# EAGLE schematic rStep_v1 (EAGLE 5.08)

## Sheet 1 of 2
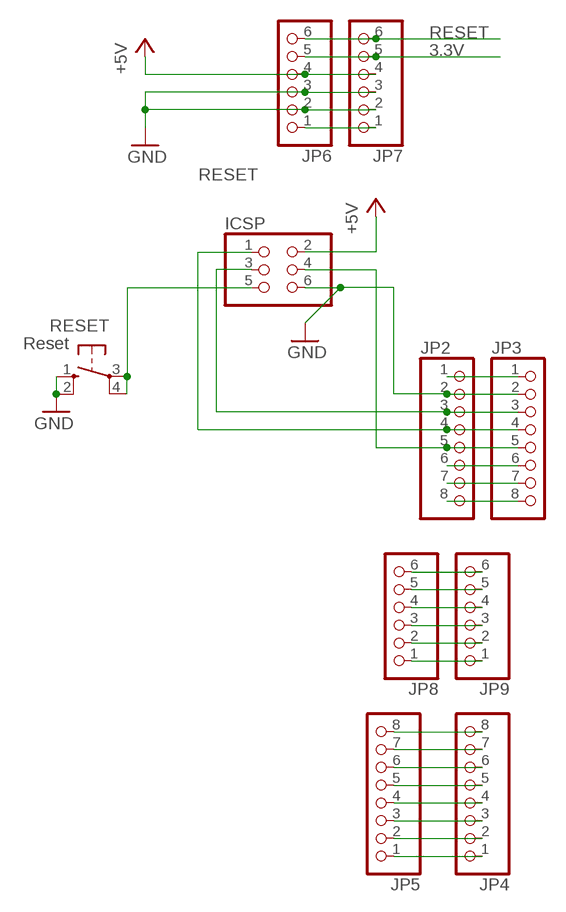
[diagram p0: schematic, sheet 1]

### Parts
ICSP  PINHD-2X3  [2X03]
JP2  PINHD-1X8B  [1X08-BIG]
JP3  PINHD-1X8CLEANBIG  [1X08-CLEANBIG]
JP4  PINHD-1X8B  [1X08-BIG]
JP5  PINHD-1X8CLEANBIG  [1X08-CLEANBIG]
JP6  PINHD-1X6CB  [1X06-CLEANBIG]
JP7  PINHD-1X6B  [1X06-BIG]
JP8  PINHD-1X6CB  [1X06-CLEANBIG]
JP9  PINHD-1X6B  [1X06-BIG]
RESET  Reset  10-XX  [B3F-10XX]

### Nets
3.3V: JP6.5 JP7.5
+5V: ICSP.2 JP6.4 JP7.4
GND: ICSP.6 JP2.2 JP3.2 JP6.2 JP6.3 JP7.2 JP7.3 RESET.1(S) RESET.2(S1)
N$2: ICSP.3 JP2.3 JP3.3
N$4: ICSP.1 JP2.4 JP3.4
N$5: ICSP.4 JP2.5 JP3.5
N$15: JP6.1 JP7.1
N$135: JP2.8 JP3.8
N$145: JP2.7 JP3.7
N$152: JP2.6 JP3.6
N$153: JP2.1 JP3.1
N$154: JP8.1 JP9.1
N$164: JP8.2 JP9.2
N$181: JP8.3 JP9.3
N$182: JP8.4 JP9.4
N$183: JP8.5 JP9.5
N$184: JP8.6 JP9.6
N$185: JP4.1 JP5.1
N$186: JP4.2 JP5.2
N$187: JP4.3 JP5.3
N$188: JP4.4 JP5.4
N$189: JP4.5 JP5.5
N$190: JP4.6 JP5.6
N$191: JP4.7 JP5.7
N$192: JP4.8 JP5.8
RESET: ICSP.5 JP6.6 JP7.6 RESET.3(P) RESET.4(P1)

### Notes on the sheet
- RESET

## Sheet 2 of 2
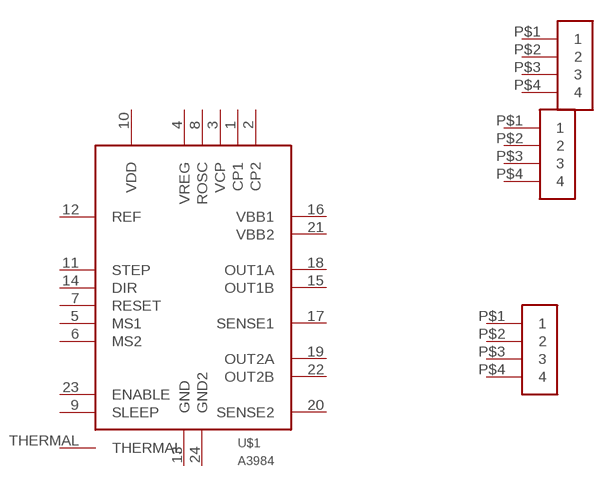
[diagram p1: schematic, sheet 2]

### Parts
U$1  A3984  [TSSOP24]
X1  284392-4  [284392-4]
X2  284392-4  [284392-4]
X3  284392-4  [284392-4]
Unconnected: U$1.1(CP1) U$1.2(CP2) U$1.3(VCP) U$1.4(VREG) U$1.5(MS1) U$1.6(MS2) U$1.7(RESET) U$1.8(ROSC) U$1.9(SLEEP) U$1.10(VDD) U$1.11(STEP) U$1.12(REF) U$1.13(GND) U$1.14(DIR) U$1.15(OUT1B) U$1.16(VBB1) U$1.17(SENSE1) U$1.18(OUT1A) U$1.19(OUT2A) U$1.20(SENSE2) U$1.21(VBB2) U$1.22(OUT2B) U$1.23(ENABLE) U$1.24(GND2) U$1.THERMAL X1.P$1 X1.P$2 X1.P$3 X1.P$4 X2.P$1 X2.P$2 X2.P$3 X2.P$4 X3.P$1 X3.P$2 X3.P$3 X3.P$4

## Library data of the parts
ICSP = pinhead:PINHD-2X3: PIN HEADER
JP2-JP5 = carduino:PINHD-1X8: PIN HEADER
JP6-JP9 = carduino:PINHD-1X6: PIN HEADER
RESET = switch-omron:10-XX: OMRON SWITCH
U$1 = rStep:A3984
X1-X3 = rStep:284392-4